# Altium project PCB_Project.PrjPcb
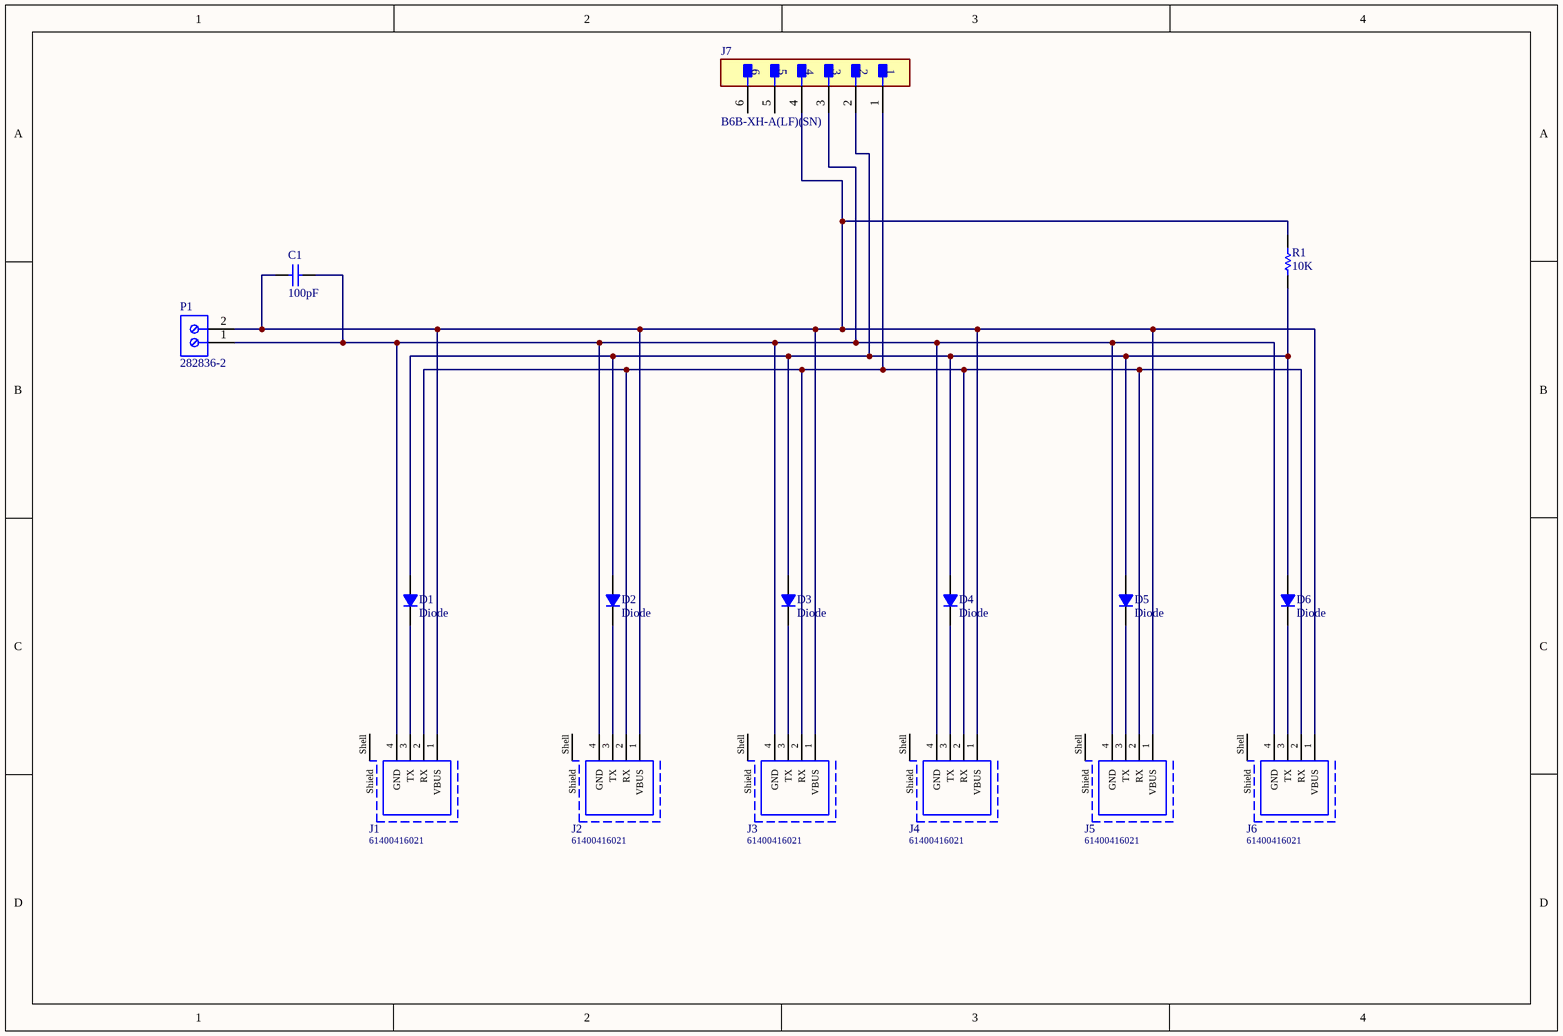
[diagram p0: Medical_PCB.SchDoc]
1 sheet, 16 parts. Net scope: global (net labels, ports and power ports of the same name join across sheets).
Board files: PCB1.PcbDoc, PCB2.PcbDoc

## Sheet Medical_PCB.SchDoc
size A4; SheetNumber: 1; SheetTotal: 1

### Parts
C1  value 100pF  [CAP 104]  (hidden comment: Cap)
D1  Diode  [DIODE 4007]
D2  Diode  [DIODE 4007]
D3  Diode  [DIODE 4007]
D4  Diode  [DIODE 4007]
D5  Diode  [DIODE 4007]
D6  Diode  [DIODE 4007]
J1  61400416021  [61400416021]
J2  61400416021  [61400416021]
J3  61400416021  [61400416021]
J4  61400416021  [61400416021]
J5  61400416021  [61400416021]
J6  61400416021  [61400416021]
J7  B6B-XH-A(LF)(SN)  [FP-B6B-XH-A_LF_SN-MFG]
P1  282836-2  [TECO-282836-2_V]
R1  value 10K  [Res 1/2WatT]  (hidden comment: Resistor)

### Nets
NetC1_1: C1.1 J1.1(VBUS) J2.1(VBUS) J3.1(VBUS) J4.1(VBUS) J5.1(VBUS) J6.1(VBUS) J7.4 P1.2 R1.1
NetC1_2: C1.2 J1.4(GND) J2.4(GND) J3.4(GND) J4.4(GND) J5.4(GND) J6.4(GND) J7.3 P1.1
NetD1_1: D1.1(A) D2.1(A) D3.1(A) D4.1(A) D5.1(A) D6.1(A) J7.2 R1.2
NetD1_2: D1.2(K) J1.3(TX)
NetD2_2: D2.2(K) J2.3(TX)
NetD3_2: D3.2(K) J3.3(TX)
NetD4_2: D4.2(K) J4.3(TX)
NetD5_2: D5.2(K) J5.3(TX)
NetD6_2: D6.2(K) J6.3(TX)
NetJ1_2: J1.2(RX) J2.2(RX) J3.2(RX) J4.2(RX) J5.2(RX) J6.2(RX) J7.1

Not connected (* = marked no-connect by the designer): J1 Shell(Shield); J2 Shell(Shield); J3 Shell(Shield); J4 Shell(Shield); J5 Shell(Shield); J6 Shell(Shield); J7 5 6

### Library data of the parts
C1 = Cap: Capacitor; Published: 8-Jun-2000; LatestRevisionDate: 17-Jul-2002; LatestRevisionNote: Re-released for DXP Platform.; PackageReference: RAD-0.3; Publisher: Altium Limited; PackageDescription: Radial Cap, Thru-Hole; 2 Leads; 0.3 in Pin Spacing
D1-D6 = Diode: Default Diode; Published: 8-Jun-2000; LatestRevisionDate: 17-Jul-2002; LatestRevisionNote: Re-released for DXP Platform.; PackageVersion: Sep-1996; PackageReference: SMC; Publisher: Altium Limited; PackageDescription: DO-214-AB/SMC; 2 C-Bend Leads; Body 7.9 x 5.9 mm, inc. leads (LxW); Code_JEDEC: DO-214-AB
J1-J6 = CMP-1502-03227-1: USB 2.0 Type A Receptacle WR-COM, Horizontal, THT; Manufacturer: Wurth Elektronik; Working Voltage: 30VAC; Rated Current: 1.5A; Contact Resistance: 20mOhm; Manufacturer URL: http://www.we-online.de; Publisher: WurthElektronik; Packaging: Tray; Operating Temperature: -40to105degC; Orientation: Horizontal; Mounting Technology: THT; Part Number: 61400416021; Gender: Receptacle; Package Reference: 61400416021; Connector Type: USB2.0TypeA; Datasheet URL: https://katalog.we-online.de/em/datasheet/61400416021.pdf
J7 = CMP-17439-000076-1: CONN HEADER VERT 6POS 2.5MM
P1 = CMP-1684-00017-1: Female Header, Pitch 5 mm, 1 x 2 Position, Height 10 mm, Tail Length 3.5 mm, Rohs, Bulk; Manufacturer: TE Connectivity; Wire Gauge: 16-30AWG; Product Training Modules: Wire-to-BoardEurostyleTerminalBlocks; Clamp Material - Plating: Brass-NickelPlated; Voltage: 300V; Mating Orientation: HorizontalwithBoard; Current: 13.5A; Pitch: 0.197"(5.00mm); Screw Thread: M3; 3D Model: 282836-2.pdf; Other Names: 5ULV-02B / A98076; Dynamic Catalog: BuchananSeries; Number of Levels: 1; Torque - Screw: 0.68Nm(6Lb-In); Featured Product: EurostyleTerminalBlockConnectors; Positions Per Level: 2; Wire Termination: Screw-RisingCageClamp; Datasheet URL: http://www.te.com.cn/commerce/DocumentDelivery/DDEController?Action=showdoc&DocId=Catalog+Section%7F1308389_EUROSTYLE_TERMINAL_BLOCKS%7F0607%7Fpdf%7FEnglish%7FENG_CS_1308389_EUROSTYLE_TERMINAL_BLOCKS_0607.pdf%7F282836-2; Color: Green; Family: TerminalBlocks-WiretoBoard; RoHS Information: 282836-2StatementofCompliance; Standard Package: 300; Contact Material - Plating: Brass-TinPlated; Manufacturer URL: http://www.te.com; Housing Material: Polyamide(PA66),Nylon6/6; Features: Interlocking(Side); Package Description: Female Header, Pitch 5 mm, 1 x 2 Position, Height 10 mm, Tail Length 3.5 mm; Mounting Type: ThroughHole; Package Reference: THD; Packaging: Bulk; Series: Buchanan; Category: Connectors,Interconnects; Screw Material - Plating: Brass-NickelPlated
R1 = Resistor: Published: 8-Jun-2000; LatestRevisionDate: 17-Jul-2002; LatestRevisionNote: Re-released for DXP Platform.; PackageReference: AXIAL-0.3; Publisher: Altium Limited; PackageDescription: Axial Device, Thru-Hole; 2 Leads; 0.3 in Pin Spacing